# Altium schematic sheet CMandLS.SchDoc
size A; SheetNumber: 7; SheetTotal: 10
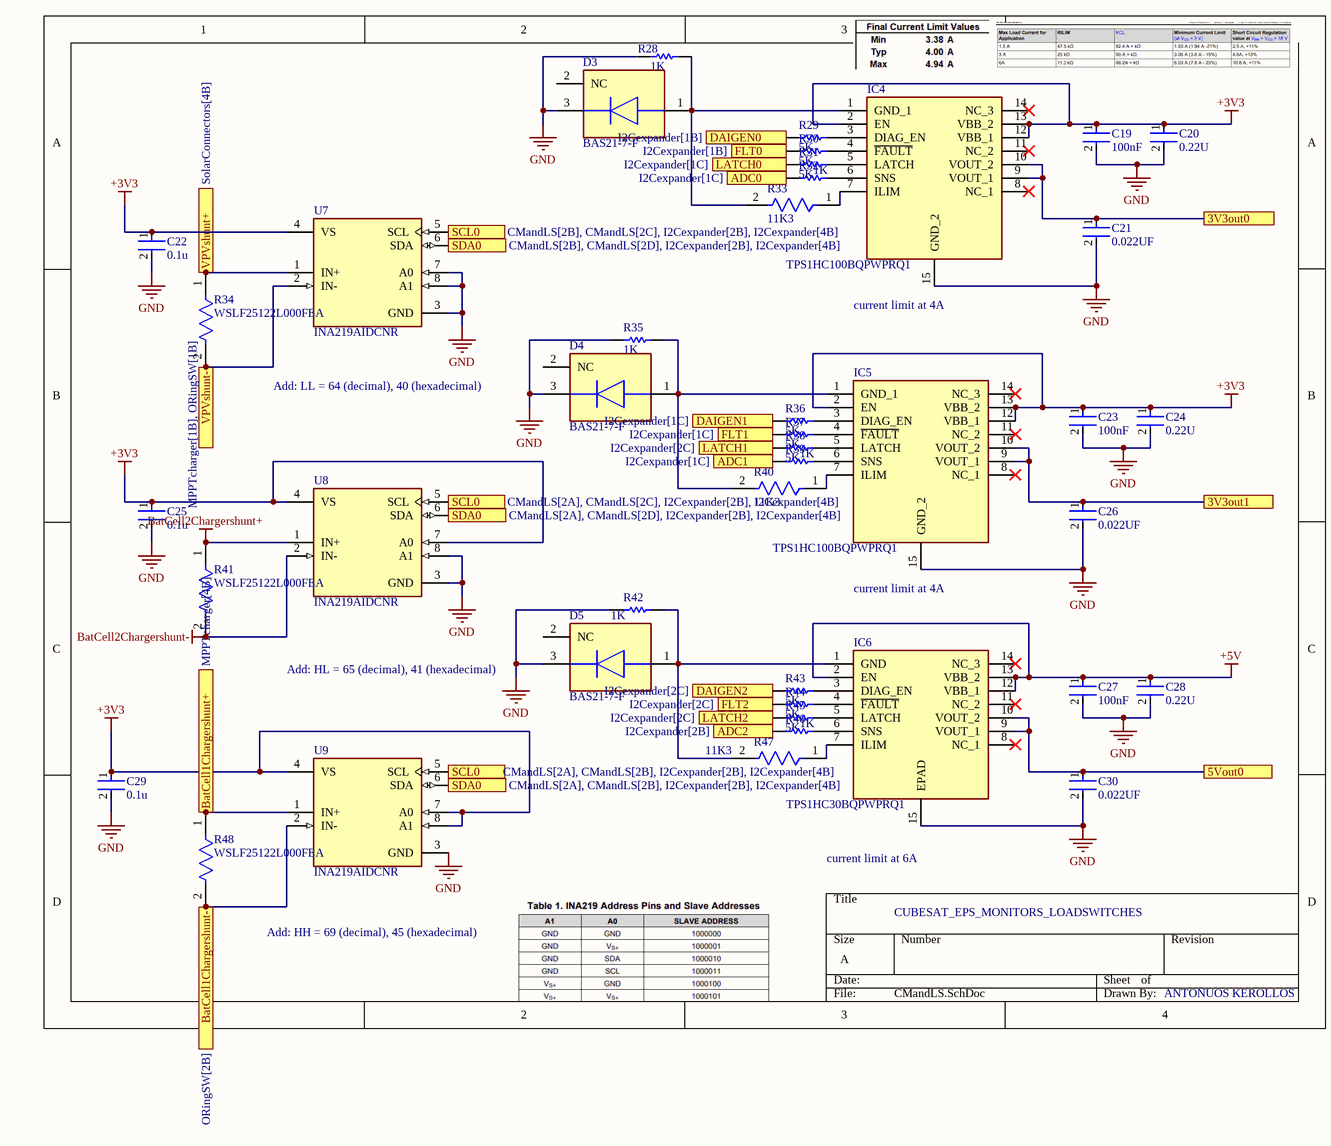
[diagram p0: CMandLS.SchDoc]

## Parts
C19  100nF  [FP-0805-L_2_01_0_2-W_1_25-IPC_B]
C20  0.22U  [FP-C0805C-DN-MFG]
C21  0.022UF  [FP-C0805C-DN-MFG]
C22  0.1u  [FP-C0402-BB-MFG]
C23  100nF  [FP-0805-L_2_01_0_2-W_1_25-IPC_B]
C24  0.22U  [FP-C0805C-DN-MFG]
C25  0.1u  [FP-C0402-BB-MFG]
C26  0.022UF  [FP-C0805C-DN-MFG]
C27  100nF  [FP-0805-L_2_01_0_2-W_1_25-IPC_B]
C28  0.22U  [FP-C0805C-DN-MFG]
C29  0.1u  [FP-C0402-BB-MFG]
C30  0.022UF  [FP-C0805C-DN-MFG]
D3  BAS21-7-F  [FP-SOT23-MFG]
D4  BAS21-7-F  [FP-SOT23-MFG]
D5  BAS21-7-F  [FP-SOT23-MFG]
IC4  TPS1HC100BQPWPRQ1  [SOP65P640X120-15N]
IC5  TPS1HC100BQPWPRQ1  [SOP65P640X120-15N]
IC6  TPS1HC30BQPWPRQ1  [SOP65P640X120-15N]
R28  1K  [RESC2013X60X35ML10T20]
R29  5K  [RESC2013X50X30ML20T20]
R30  5K  [RESC2013X50X30ML20T20]
R31  5K  [RESC2013X50X30ML20T20]
R32  1K  [RESC2013X60X35ML10T20]
R33  11K3  [FP-CRCW0805-e3-IPC_A]
R34  WSLF25122L000FEA  [FP-WSLF25122L000FEA-MFG]
R35  1K  [RESC2013X60X35ML10T20]
R36  5K  [RESC2013X50X30ML20T20]
R37  5K  [RESC2013X50X30ML20T20]
R38  5K  [RESC2013X50X30ML20T20]
R39  1K  [RESC2013X60X35ML10T20]
R40  11K3  [FP-CRCW0805-e3-IPC_A]
R41  WSLF25122L000FEA  [FP-WSLF25122L000FEA-MFG]
R42  1K  [RESC2013X60X35ML10T20]
R43  5K  [RESC2013X50X30ML20T20]
R44  5K  [RESC2013X50X30ML20T20]
R45  5K  [RESC2013X50X30ML20T20]
R46  1K  [RESC2013X60X35ML10T20]
R47  11K3  [FP-CRCW0805-e3-IPC_A]
R48  WSLF25122L000FEA  [FP-WSLF25122L000FEA-MFG]
U7  INA219AIDCNR  [FP-DCN0008A-IPC_B]
U8  INA219AIDCNR  [FP-DCN0008A-IPC_B]
U9  INA219AIDCNR  [FP-DCN0008A-IPC_B]

## Ports
3V3out0, 3V3out1, 5Vout0, ADC0 (see I2Cexpander[1C]), ADC1 (see I2Cexpander[1C]), ADC2 (see I2Cexpander[2B]), BatCell1Chargershunt+ (see MPPTcharger[4B]), BatCell1Chargershunt- (see ORingSW[2B]), DAIGEN0 (see I2Cexpander[1B]), DAIGEN1 (see I2Cexpander[1C]), DAIGEN2 (see I2Cexpander[2C]), FLT0 (see I2Cexpander[1B]), FLT1 (see I2Cexpander[1C]), FLT2 (see I2Cexpander[2C]), LATCH0 (see I2Cexpander[1C]), LATCH1 (see I2Cexpander[2C]), LATCH2 (see I2Cexpander[2C]), SCL0 (see CMandLS[2A], CMandLS[2B], I2Cexpander[2B], I2Cexpander[4B]), SCL0 (see CMandLS[2A], CMandLS[2C], I2Cexpander[2B], I2Cexpander[4B]), SCL0 (see CMandLS[2B], CMandLS[2C], I2Cexpander[2B], I2Cexpander[4B]), SDA0 (see CMandLS[2A], CMandLS[2B], I2Cexpander[2B], I2Cexpander[4B]), SDA0 (see CMandLS[2A], CMandLS[2D], I2Cexpander[2B], I2Cexpander[4B]), SDA0 (see CMandLS[2B], CMandLS[2D], I2Cexpander[2B], I2Cexpander[4B]), VPVshunt+ (see SolarConnectors[4B]), VPVshunt- (see MPPTcharger[1B], ORingSW[1B])

## Nets
+3V3: C19.1 C20.1 C22.1 C23.1 C24.1 C25.1 C29.1 IC4.2(EN) IC4.12(VBB_1) IC4.13(VBB_2) IC5.2(EN) IC5.12(VBB_1) IC5.13(VBB_2) U7.4(VS) U8.4(VS) U8.7(A0) U9.4(VS) U9.7(A0) U9.8(A1)
+5V: C27.1 C28.1 IC6.2(EN) IC6.12(VBB_1) IC6.13(VBB_2)
BatCell2Chargershunt+: R41.1 U8.1(IN+)
BatCell2Chargershunt-: R41.2 U8.2(IN-)
GND: C19.2 C20.2 C21.2 C22.2 C23.2 C24.2 C25.2 C26.2 C27.2 C28.2 C29.2 C30.2 D3.3(C) D4.3(C) D5.3(C) IC4.15(GND_2) IC5.15(GND_2) IC6.15(EPAD) R28.2 R35.2 R42.2 U7.3(GND) U7.7(A0) U7.8(A1) U8.3(GND) U8.8(A1) U9.3(GND)
3V3out0: C21.1 IC4.9(VOUT_1) IC4.10(VOUT_2) ; port 3V3out0
3V3out1: C26.1 IC5.9(VOUT_1) IC5.10(VOUT_2) ; port 3V3out1
5Vout0: C30.1 IC6.9(VOUT_1) IC6.10(VOUT_2) ; port 5Vout0
ADC0: R32.1 ; port ADC0
ADC1: R39.1 ; port ADC1
ADC2: R46.1 ; port ADC2
BatCell1Chargershunt+: R48.1 U9.1(IN+) ; port BatCell1Chargershunt+
BatCell1Chargershunt-: R48.2 U9.2(IN-) ; port BatCell1Chargershunt-
DAIGEN0: R29.1 ; port DAIGEN0
DAIGEN1: R36.1 ; port DAIGEN1
DAIGEN2: R43.1 ; port DAIGEN2
FLT0: R30.1 ; port FLT0
FLT1: R37.1 ; port FLT1
FLT2: R44.1 ; port FLT2
LATCH0: R31.1 ; port LATCH0
LATCH1: R38.1 ; port LATCH1
LATCH2: R45.1 ; port LATCH2
SCL0: U7.5(SCL) U8.5(SCL) U9.5(SCL) ; port SCL0
SDA0: U7.6(SDA) U8.6(SDA) U9.6(SDA) ; port SDA0
VPVshunt+: R34.1 U7.1(IN+) ; port VPVshunt+
VPVshunt-: R34.2 U7.2(IN-) ; port VPVshunt-
NetD3_1: D3.1(A) IC4.1(GND_1) R28.1 R33.2
NetD4_1: D4.1(A) IC5.1(GND_1) R35.1 R40.2
NetD5_1: D5.1(A) IC6.1(GND) R42.1 R47.2
NetIC4_3: IC4.3(DIAG_EN) R29.2
NetIC4_4: IC4.4(~{FAULT}) R30.2
NetIC4_5: IC4.5(LATCH) R31.2
NetIC4_6: IC4.6(SNS) R32.2
NetIC4_7: IC4.7(ILIM) R33.1
NetIC5_3: IC5.3(DIAG_EN) R36.2
NetIC5_4: IC5.4(~{FAULT}) R37.2
NetIC5_5: IC5.5(LATCH) R38.2
NetIC5_6: IC5.6(SNS) R39.2
NetIC5_7: IC5.7(ILIM) R40.1
NetIC6_3: IC6.3(DIAG_EN) R43.2
NetIC6_4: IC6.4(~{FAULT}) R44.2
NetIC6_5: IC6.5(LATCH) R45.2
NetIC6_6: IC6.6(SNS) R46.2
NetIC6_7: IC6.7(ILIM) R47.1

Not connected (* = marked no-connect by the designer): D3 2(NC); D4 2(NC); D5 2(NC); IC4 8(NC_1)* 11(NC_2)* 14(NC_3)*; IC5 8(NC_1)* 11(NC_2)* 14(NC_3)*; IC6 8(NC_1)* 11(NC_2)* 14(NC_3)*

## Notes on the sheet
- (near IC4) current limit at 4A
- Add: LL = 64 (decimal), 40 (hexadecimal)
- (near IC5) current limit at 4A
- (near D5) Add: HL = 65 (decimal), 41 (hexadecimal)
- current limit at 6A
- CUBESAT_EPS_MONITORS_LOADSWITCHES
- Add: HH = 69 (decimal), 45 (hexadecimal)
- ANTONUOS KEROLLOS

## Library data of the parts
C19 C23 C27 = CMP-2007-04172-2: Automotive Ceramic Capacitor, 0805, 100nF, 10%, X7R, 15%, 100V; Voltage Rating (DC): 100V; Case Code (Metric): 2012; Mount: Surface Mount; Length: 2.01mm; Depth: 1.25mm; Lead Free: Lead Free; Ratings: AEC-Q200; Max Operating Temperature: 125°C; Tolerance: 10%; Case/Package: 0805; Width: 0.049inch; Package Quantity: 1; Thickness: 0.055inch; Construction: Flat; Min Operating Temperature: -55°C; REACH SVHC: No SVHC; Number of Pins: 2; Radiation Hardening: No; Capacitance: 100nF; Voltage Rating: 100V; Height: 1.4mm; Series: -; Voltage: 100V; Dielectric: X7R; Termination: SMD/SMT; Case Code (Imperial): 0805; RoHS Compliant: Yes; Packaging: Tape and Reel; Dielectric Material: Ceramic
C20 C24 C28 = CMP-2007-03262-2: CAP CER 0.22UF 100V 10% X7R 0805; Manufacturer Part Number: C0805C224K1RACTU; Manufacturer: KEMET; Material: Ceramic; Tolerance: 0.1; Value: 0.22 μF; Temperature Coefficient: 30ppm/°C; Temperature Range High: +125°C; Temperature Range Low: -55°C; Voltage Rating: 100 V; Device Class L2: Capacitors; Octopart: https://octopart.com/c0805c224k1ractu-kemet-12818106; ComponentLink2URL: https://content.kemet.com/datasheets/KEM_C1003_C0G_SMD.pdf; RoHS: TRUE; Temperature: -55°C to +125°C; Ipc Land Pattern Name: CAPC200125X78; Category: Cap; ComponentLink2Description: Datasheet; Height: 0.88mm; Device Class L1: Passive Components; Digikey Description: CAP CER 0.22UF 100V 10% X7R 0805; Mouser Description: 0805 C 220nF Ceramic Multilayer Capacitor, 100 V, +125degC, X7R Dielec, +/-10%; Capacitance: 0.22 μF; Package: C0805C-DN; Lead Free: Yes; Automotive: No; Temperature Characteristic: X7R; Device Class L3: Ceramic Capacitors
C21 C26 C30 = CMP-2007-00338-2: CAP CER 0.022UF 50V X7R 0805; Manufacturer: KEMET; Manufacturer Part Number: C0805C223K5RACTU; Value: 22,000 pF; Material: Ceramic; Tolerance: 0.1; Temperature Coefficient: 30ppm/°C; Automotive: No; Package: C0805C-DN; RoHS: TRUE; Height: 0.88mm; Lead Free: Yes; Temperature Range Low: -55°C; Digikey Description: CAP CER 0.022UF 50V X7R 0805; ComponentLink2Description: Datasheet; Capacitance: 22,000 pF; Mouser Description: Capacitor; Ceramic; Cap; .022uF; Tol 10%; SMT; Vol-Rtg 50V; X7R; Tape and Reel; Device Class L3: Ceramic Capacitors; Category: Cap; Voltage Rating: 50 V; Temperature Characteristic: X7R; Ipc Land Pattern Name: CAPC200125X78; Octopart: https://octopart.com/c0805c223k5ractu-kemet-145968; Device Class L1: Passive Components; Temperature: -55°C to +125°C; ComponentLink2URL: https://content.kemet.com/datasheets/KEM_C1003_C0G_SMD.pdf; Temperature Range High: +125°C; Device Class L2: Capacitors
C22 C25 C29 = CMP-2008-02046-2: CAP CER 0.1UF 10V X5R 0402; Manufacturer: Kemet; Manufacturer Part Number: C0402C104K8PACTU; Material: Ceramic; Capacitance: 0.10 μF; Temperature Coefficient: 15%; Tolerance: 0.1; Value: 0.10 μF; Package: C0402-BB; Temperature: -55°C to +125°C; ComponentLink2Description: Datasheet; Temperature Characteristic: X5R; Device Class L1: Passive Components; Height: 0.55mm; Lead Free: Yes; ComponentLink2URL: https://content.kemet.com/datasheets/KEM_C1002_X7R_SMD.pdf; Device Class L2: Capacitors; Temperature Range Low: -55°C; Temperature Range High: +125°C; RoHS: TRUE; Octopart: https://octopart.com/c0402c104k8pactu-kemet-140039; Automotive: No; Mouser Description: Capacitor 100 nF 10 VDC 0402; Category: Cap; Voltage Rating: 10 V; Digikey Description: CAP CER 0.1UF 10V X5R 0402; Ipc Land Pattern Name: CAPC10050X50; Device Class L3: Ceramic Capacitors
D3-D5 = CMP-12791-000036-1: DIODE GEN PURP 200V 200MA SOT23; Manufacturer: Diodes Inc.; Max Repetitive Reverse Voltage: 250V; Forward Current: 400mA; Max Surge Forward Current: 0.5A; Standoff Height: 0.013mm; Capacitance: 5pF; Max Junction Temp: +150°C; Peak Reverse Current: 0.1uA; Value: 5pF; Device Class L1: Discrete Semiconductors; Category: Diode; Mouser Description: Diodes - General Purpose, Power, Switching 200V 350mW; Digikey Description: DIODE GEN PURP 200V 200MA SOT23; Manufacturer Part Number: BAS21-7-F; Device Class L2: Diodes; RoHS: TRUE; Device Class L3: Rectifier Diodes; Lead Free: Yes; Temperature Range High: +150°C; Ipc Land Pattern Name: SOT92P240X102-3; ComponentLink2Description: Datasheet; Octopart: https://octopart.com/bas21-7-f-diodes+inc.-325943; Reverse Voltage: 200V; Height: 1.1mm; Automotive: No; ComponentLink2URL: https://www.diodes.com/assets/Datasheets/Ds12004.pdf; Temperature: -65°C to +150°C; Temperature Range Low: -65°C; Footprint Url: https://www.diodes.com/assets/Package-Files/SOT23.pdf; Package: SOT23
IC4 IC5 = TPS1HC100BQPWPRQ1: Integrated Circuit; Manufacturer_Name: Texas Instruments; Datasheet Link: https://www.ti.com/lit/ds/symlink/tps1hc100-q1.pdf?ts=1676455142846&ref_url=https%253A%252F%252Fwww.ti.com%252Fproduct%252FTPS1HC100-Q1%252Fpart-details%252FTPS1HC100BQPWPRQ1; Height: 1.2mm; Manufacturer_Part_Number: TPS1HC100BQPWPRQ1; Mouser Part Number: 595-PS1HC100BQPWPRQ1; Mouser Price/Stock: https://www.mouser.co.uk/ProductDetail/Texas-Instruments/TPS1HC100BQPWPRQ1?qs=doiCPypUmgGr2qWxBCPLzg%3D%3D
IC6 = TPS1HC30BQPWPRQ1: Integrated Circuit; Manufacturer_Name: Texas Instruments; Datasheet Link: https://www.ti.com/lit/ds/symlink/tps1hc30-q1.pdf?ts=1709608283144&ref_url=https%253A%252F%252Fwww.ti.com%252Fproduct%252FTPS1HC30-Q1%252Fpart-details%252FTPS1HC30BQPWPRQ1; Height: 1.2mm; Manufacturer_Part_Number: TPS1HC30BQPWPRQ1; Mouser Part Number: 595-TPS1HC30BQPWPRQ1; Mouser Price/Stock: https://www.mouser.co.uk/ProductDetail/Texas-Instruments/TPS1HC30BQPWPRQ1?qs=rQFj71Wb1eWIl26jD%2FvpUw%3D%3D
R28 R32 R35 R39 R42 R46 = CMP-2100-03671-1: Chip Resistor, 1 KOhm, +/- 1%, 125 mW, -55 to 155 degC, 0805 (2012 Metric), RoHS, Tape and Reel; Manufacturer: Yageo; Temperature Coefficient: 100ppm/degreesC; Voltage Rating (DC): 150V; Max Power Dissipation: 125mW; Resistance: 1KOhm; Number of Pins: 2; Number of Terminations: 2; Datasheet URL: http://www.yageo.com/NewPortal/yageodocoutput?fileName=/pdf/R-Chip/PYu-RC_Group_51_RoHS_L_5.pdf; Length: 0.079inch; Package Description: 2-Pin Surface Mounted Device, Body 2 x 1.25 mm; Depth: 1.25mm; Height: 0.024inch; Military Standard: Not; Case/Package: 0805; Package Reference: 0805; RoHSCompliant: true; Lead Free: LeadFree; Packaging: TapeandReel; Package Quantity: 1; Datasheet Version: Rev. 5, 10/2016; Tolerance: 1%; Min Operating Temperature: -55degC; Voltage Rating: 150V; Composition: ThickFilm; Case Code (Imperial): 0805; Power Rating: 125mW; Width: 0.049inch; Case Code (Metric): 2012; Manufacturer URL: http://www.yageo.com/; Max Operating Temperature: 155degC; REACH SVHC: Unknown; Termination: SMD/SMT
R29-R31 R36-R38 R43-R45 = CMP-2001-04239-1: Part Number: CRCW08055K00FKTA; Manufacturer: Vishay Dale
R33 R40 R47 = CMP-02407-005171-1: RES Thick Film, 11.3kΩ, 1%, 0.125W, 100ppm/°C, 0805; Max Power Dissipation: 125mW; Voltage Rating: 150V; Resistance: 11.3kR; Termination: SMD/SMT; Case/Package: 0805; Composition: Thick Film; Height: 0.45mm; Temperature Coefficient: 100ppm/°C; Features: Automotive AEC-Q200; Min Operating Temperature: -55°C; Width: 0.049inch; Case Code (Metric): 2012; Voltage Rating (DC): 150V; Packaging: Tape and Reel; Case Code (Imperial): 0805; Length: 2mm; Tolerance: 1%; Number of Terminations: 2; Contact Plating: Tin; Weight: 0.000194oz; Depth: 1.25mm; Max Operating Temperature: 155°C; Power Rating: 125mW; Military Standard: Not; Package Quantity: 10; Radiation Hardening: No; Lead Free: Lead Free
R34 R41 R48 = CMP-02407-012168-1: RES 0.002 OHM 1% 5W 2512; Resistance: 2mR; Temperature Coefficient: 70ppm/°C; RoHS Compliant: Yes; Case/Package: 2512; Length: 0.25inch; Height: 0.024inch; Max Power Dissipation: 5W; Lead Free: Lead Free; Features: Moisture Resistant; Min Operating Temperature: -65°C; Max Operating Temperature: 170°C; Case Code (Metric): 6432; Tolerance: 1%; Width: 0.125inch; Case Code (Imperial): 2512; Packaging: Tape and Reel; Resistor Type: Metal Element; Number of Terminations: 2
U7-U9 = CMP-0704-00041-3: IC CURRENT MONITOR 1% SOT23-8; Common Mode Rejection Ratio: 100dB; Bandwidth: 3.4MHz; Operating Supply Current: 1mA; Nominal Supply Current: 700uA; Min Input Voltage: 0V; Output Current per Channel: 10mA; Number of Amplifiers: 1; Input Offset Voltage (Vos): 100uV; Max Input Voltage: 26V; Min Supply Voltage: 3V; Max Supply Current: 5mA; Max Supply Voltage: 5.5V; Output Type: Digital; Accuracy: 1%; Radiation Hardening: No; Min Operating Temperature: -40°C; Contact Plating: Gold; REACH SVHC: No SVHC; Packaging: Tape and Reel; Max Operating Temperature: 125°C; Lead Free: Lead Free; Weight: 0.001411oz; Supply Current: 700uA; Number of Pins: 8; Length: 3mm; Quiescent Current: 700uA; Features: I²C; Height: 1.3mm; Output Current: 10mA; Case/Package: SOT-23-8; RoHS Compliant: Yes; Width: 1.75mm; Package Quantity: 3000; Series: Zero-Drift